# EAGLE design HiFi_Module_r1_3 (EAGLE 9.6.2)
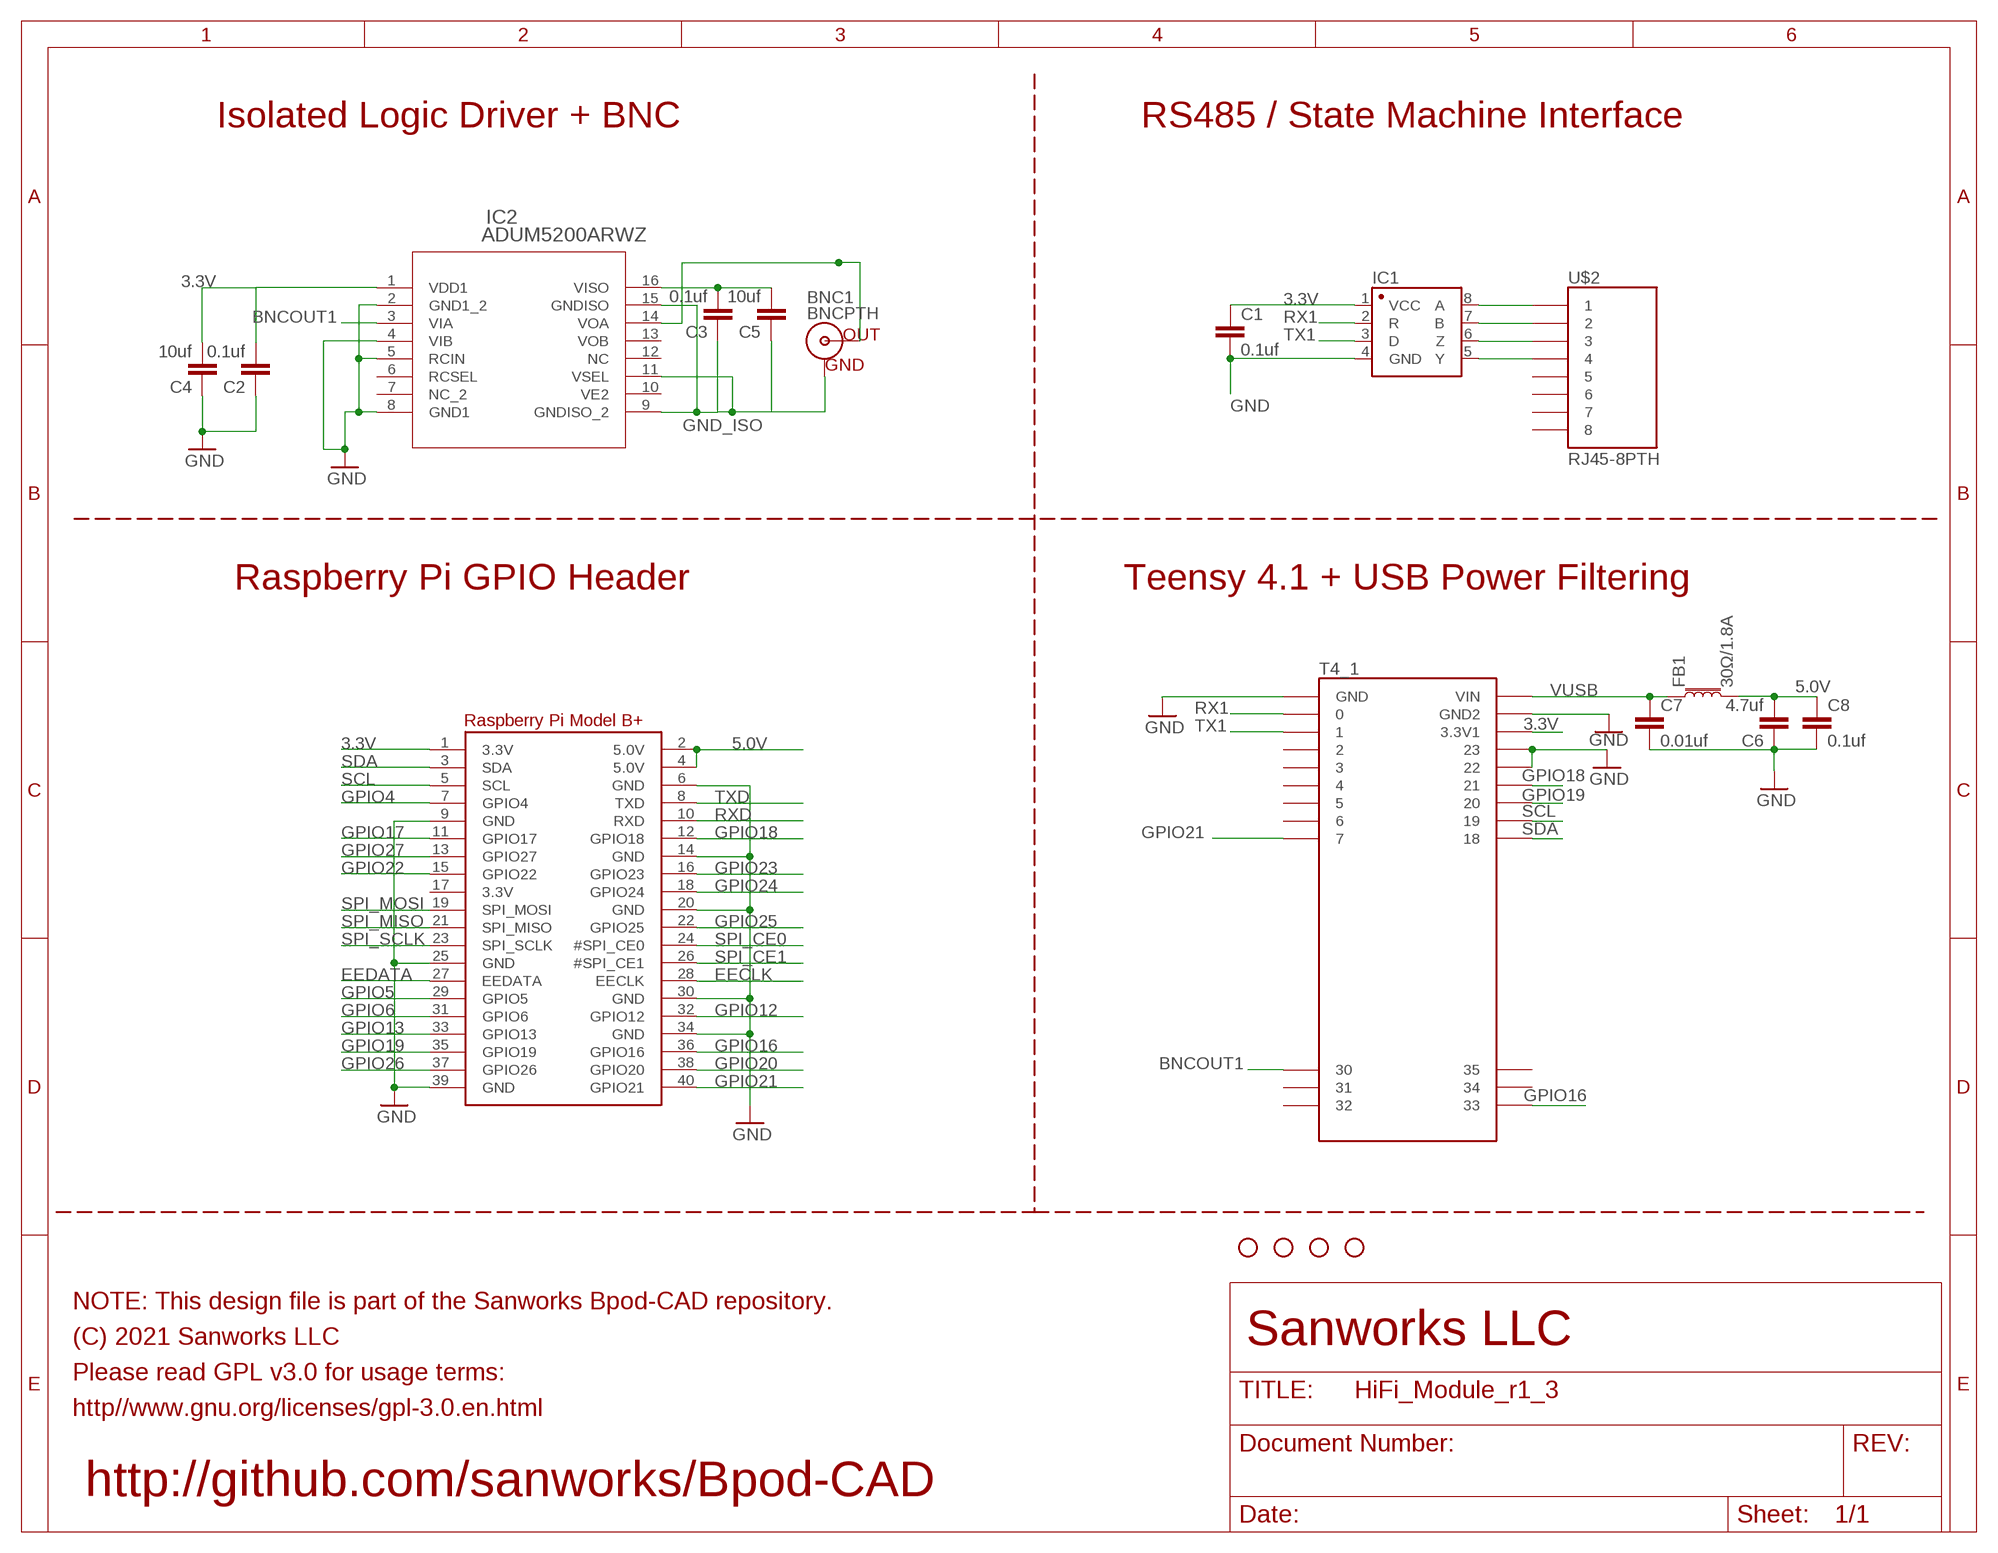
[diagram p0: schematic, sheet 1]

## Parts
BNC1  BNCPTH  [BNC]
C1  0.1uf  10UF-0805-10V-10%  [0805]
C2  0.1uf  10UF-0805-10V-10%  [0805]
C3  0.1uf  10UF-0805-10V-10%  [0805]
C4  10uf  CAP1206  [1206@2]
C5  10uf  CAP1206  [1206@2]
C6  4.7uf  CAP1206  [1206@2]
C7  0.01uf  10UF-0805-10V-10%  [0805]
C8  0.1uf  10UF-0805-10V-10%  [0805]
FB1  30Ω/1.8A  FERRITE_BEAD-0603  [0603]
H1  STAND-OFF  [STAND-OFF]
H2  STAND-OFF  [STAND-OFF]
H3  STAND-OFF  [STAND-OFF]
H4  STAND-OFF  [STAND-OFF]
IC1  SN65HVD31DR  [SO08]
IC2  ADUM5200ARWZ  [RW_16]
RPI1  RASPBERRYPI_BPLUS_IDC  [2X20]
T4_1  TEENSY4.1_FORAUDIO  [TEENSY4.1_FORAUDIO]
U$2  RJ45-8PTH  [RJ45-8]

## Nets
3.3V: C1.1 C2.2 C4.2 IC1.1(VCC) IC2.1(VDD1) RPI1.1(3.3V) T4_1.3V3_LO(3.3V1)
5.0V: C6.2 C8.1 FB1.2 RPI1.2(5.0V) RPI1.4(5.0V)
BNCOUT1: IC2.3(VIA) T4_1.30
EECLK: RPI1.28(EECLK)
EEDATA: RPI1.27(EEDATA)
GND: C1.2 C2.1 C4.1 C6.1 C7.2 C8.2 IC1.4(GND) IC2.2(GND1_2) IC2.4(VIB) IC2.5(RCIN) IC2.8(GND1) RPI1.6(GND) RPI1.9(GND) RPI1.14(GND) RPI1.20(GND) RPI1.25(GND) RPI1.30(GND) RPI1.34(GND) RPI1.39(GND) T4_1.22/A8 T4_1.23/A9 T4_1.AGND(GND) T4_1.GND(GND2)
GND_ISO: BNC1.GND C3.1 C5.1 IC2.9(GNDISO_2) IC2.11(VSEL) IC2.15(GNDISO)
GPIO4: RPI1.7(GPIO4)
GPIO5: RPI1.29(GPIO5)
GPIO6: RPI1.31(GPIO6)
GPIO12: RPI1.32(GPIO12)
GPIO13: RPI1.33(GPIO13)
GPIO16: RPI1.36(GPIO16) T4_1.33
GPIO17: RPI1.11(GPIO17)
GPIO18: RPI1.12(GPIO18) T4_1.21/A7
GPIO19: RPI1.35(GPIO19) T4_1.20/A6
GPIO20: RPI1.38(GPIO20)
GPIO21: RPI1.40(GPIO21) T4_1.7
GPIO22: RPI1.15(GPIO22)
GPIO23: RPI1.16(GPIO23)
GPIO24: RPI1.18(GPIO24)
GPIO25: RPI1.22(GPIO25)
GPIO26: RPI1.37(GPIO26)
GPIO27: RPI1.13(GPIO27)
N$1: IC1.6(Z) U$2.3
N$3: IC1.8(A) U$2.1
N$4: IC1.5(Y) U$2.4
N$5: IC1.7(B) U$2.2
N$27: C3.2 C5.2 IC2.16(VISO)
N$32: BNC1.S(OUT) IC2.14(VOA)
RX1: IC1.2(R) T4_1.0/RX
RXD: RPI1.10(RXD)
SCL: RPI1.5(SCL) T4_1.19/A5/SCL
SDA: RPI1.3(SDA) T4_1.18/A4/SDA
SPI_CE0: RPI1.24(#SPI_CE0)
SPI_CE1: RPI1.26(#SPI_CE1)
SPI_MISO: RPI1.21(SPI_MISO)
SPI_MOSI: RPI1.19(SPI_MOSI)
SPI_SCLK: RPI1.23(SPI_SCLK)
TX1: IC1.3(D) T4_1.1/TX
TXD: RPI1.8(TXD)
VUSB: C7.1 FB1.1 T4_1.VIN
Unconnected: IC2.6(RCSEL) IC2.7(NC_2) IC2.10(VE2) IC2.12(NC) IC2.13(VOB) RPI1.17(3.3V) T4_1.2 T4_1.3 T4_1.4 T4_1.5 T4_1.6 T4_1.31/A12 T4_1.32 T4_1.34 T4_1.35 U$2.5 U$2.6 U$2.7 U$2.8

## Notes on the sheet
- Isolated Logic Driver + BNC | RS485 / State Machine Interface
- Raspberry Pi GPIO Header | Teensy 4.1 + USB Power Filtering
- NOTE: This design file is part of the Sanworks Bpod-CAD repository.
- (C) 2021 Sanworks LLC | Sanworks LLC
- Please read GPL v3.0 for usage terms:
- http//www.gnu.org/licenses/gpl-3.0.en.html
- http://github.com/sanworks/Bpod-CAD

## Library data of the parts
BNC1 = SparkFun-Connectors:BNC: BNC Right Angle Connector Mouser Part# 5227161 SparkFun Products: BNC Connector - Right Angle <https://www.sparkfun.com/products/10550>; PROD_ID: LPA-12729; SF_ID: PRT-10550
C1-C3 C7 C8 = SparkFun-Capacitors:10UF: 10.0µF ceramic capacitors A capacitor is a passive two-terminal electrical component used to store electrical energy temporarily in an electric field.; PROD_ID: CAP-11330; VALUE: 10uF
C4-C6 = SparkFun-Capacitors:CAP: Capacitor Standard 0603 ceramic capacitor, and 0.1" leaded capacitor.
FB1 = SparkFun-Coils:FERRITE_BEAD: Ferrite Bead (blocks, cores, rings, chokes, etc.) Inductor with layers of ferrite used to suppress high frequencies. Often used to isolate high frequency noise. SparkFun Products: IOIO-OTG - V2.2 <https://www.sparkfun.com/products/13613> SparkFun SAMD21 Mini Breakout <https://www.sparkfun.com/products/13664> SparkFun 6 Degrees of Freedom Breakout - LSM6DS3 <https://www.sparkfun.com/products/13339> SparkFun SAMD21 Dev Breakout <https://www.sparkfun.com/products/13672>; PROD_ID: NDUC-13805
H1-H4 = SparkFun-Hardware:STAND-OFF: Stand Off Drill holes for mechanically mounting via screws, standoffs, etc. Note: Use the keepout ring to avoid running the screw head into surrounding components. Variant Overviews STAND-OFF - Mechanical footprint for a #4 phillips button head screw. STAND-OFF-TIGHT - Mechanical footprint for a #4 phillips button head screw, Example SparkFun Products Screw - Phillips Head (1/4", 4-40, 10 pack) <https://www.sparkfun.com/products/10453> (PRT-10453) Screw - Phillips Head (1/2", 4-40, 10 pack) <https://www.sparkfun.com/products/10452> (PRT-10452) Screw - Phillips Head (3/4", 4-40, 10 pack) <https://www.sparkfun.com/products/10451> (PRT-10451) Screw - Phillips Head (1", 4-40, 10 pack) <https://www.sparkfun.com/products/10450> (PRT-10450)
IC1 = Joshparts4:SN65HVD31DR: A placeholder for generic narrow & wide SOIC8 foorptints - used on the DIP adapter board.
IC2 = ADUM5200:ADUM5200ARWZ
RPI1 = microbuilder:RASPBERRYPI_BPLUS
T4_1 = teensy4.1.dist:TEENSY4.1_FORAUDIO
U$2 = SparkFun:RJ45-8: RJ45 Jack Simple RJ45, 8-pin connection - connector for common Cat5, Cat5e, and Cat6 Ethernet cables. Footprint not yet proven in production. Connector sku is PRT-00643; Breakout PCB sku is BOB-00716.

## Board
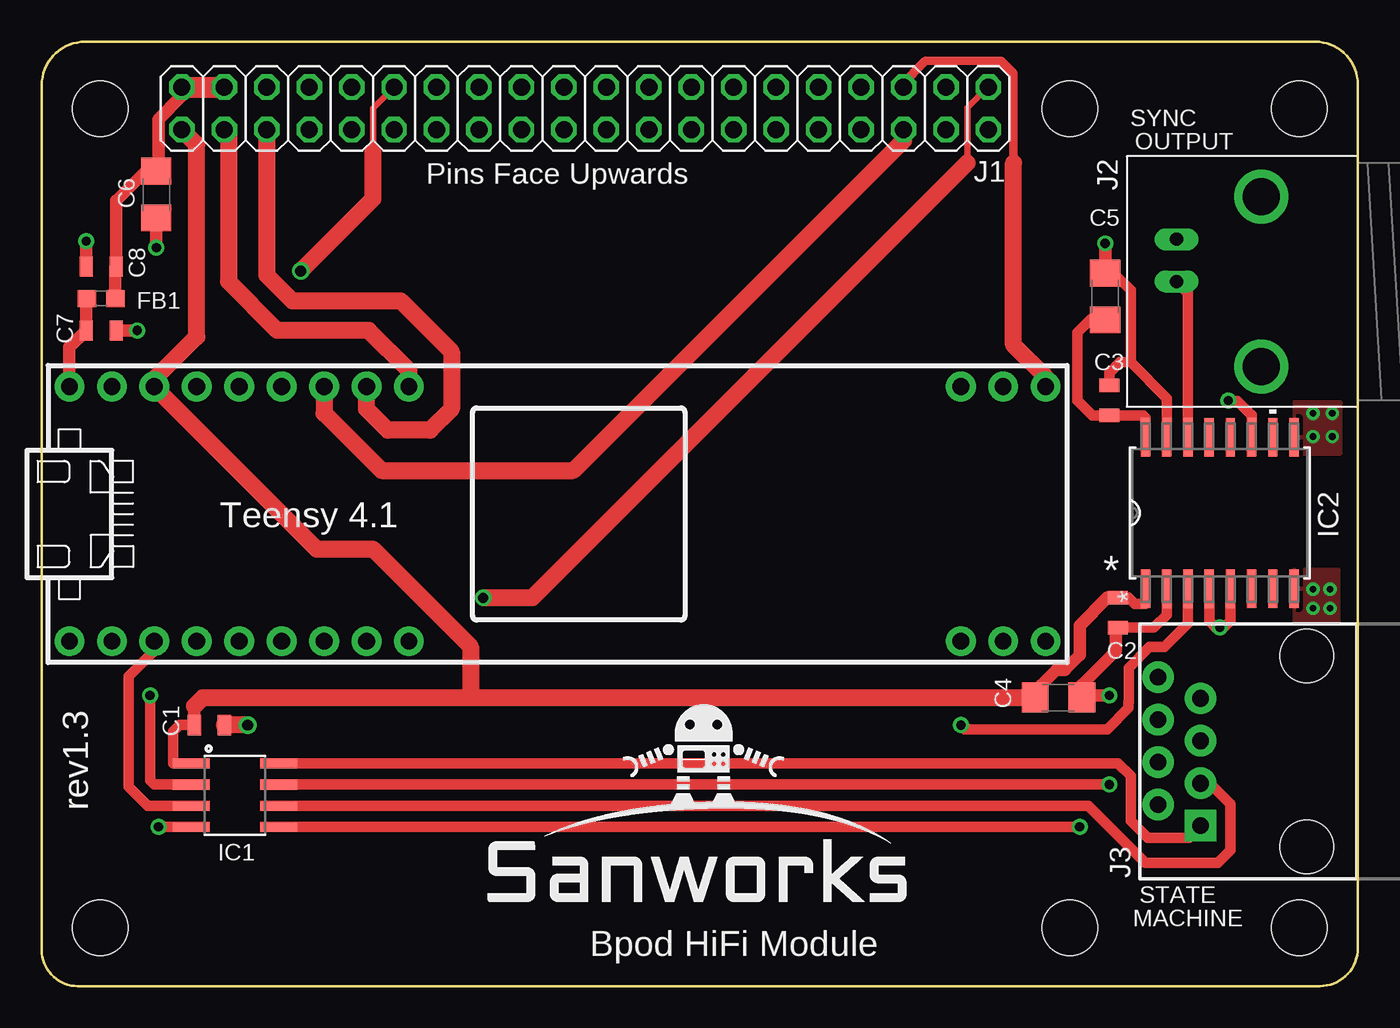
[diagram p1: board, top side]
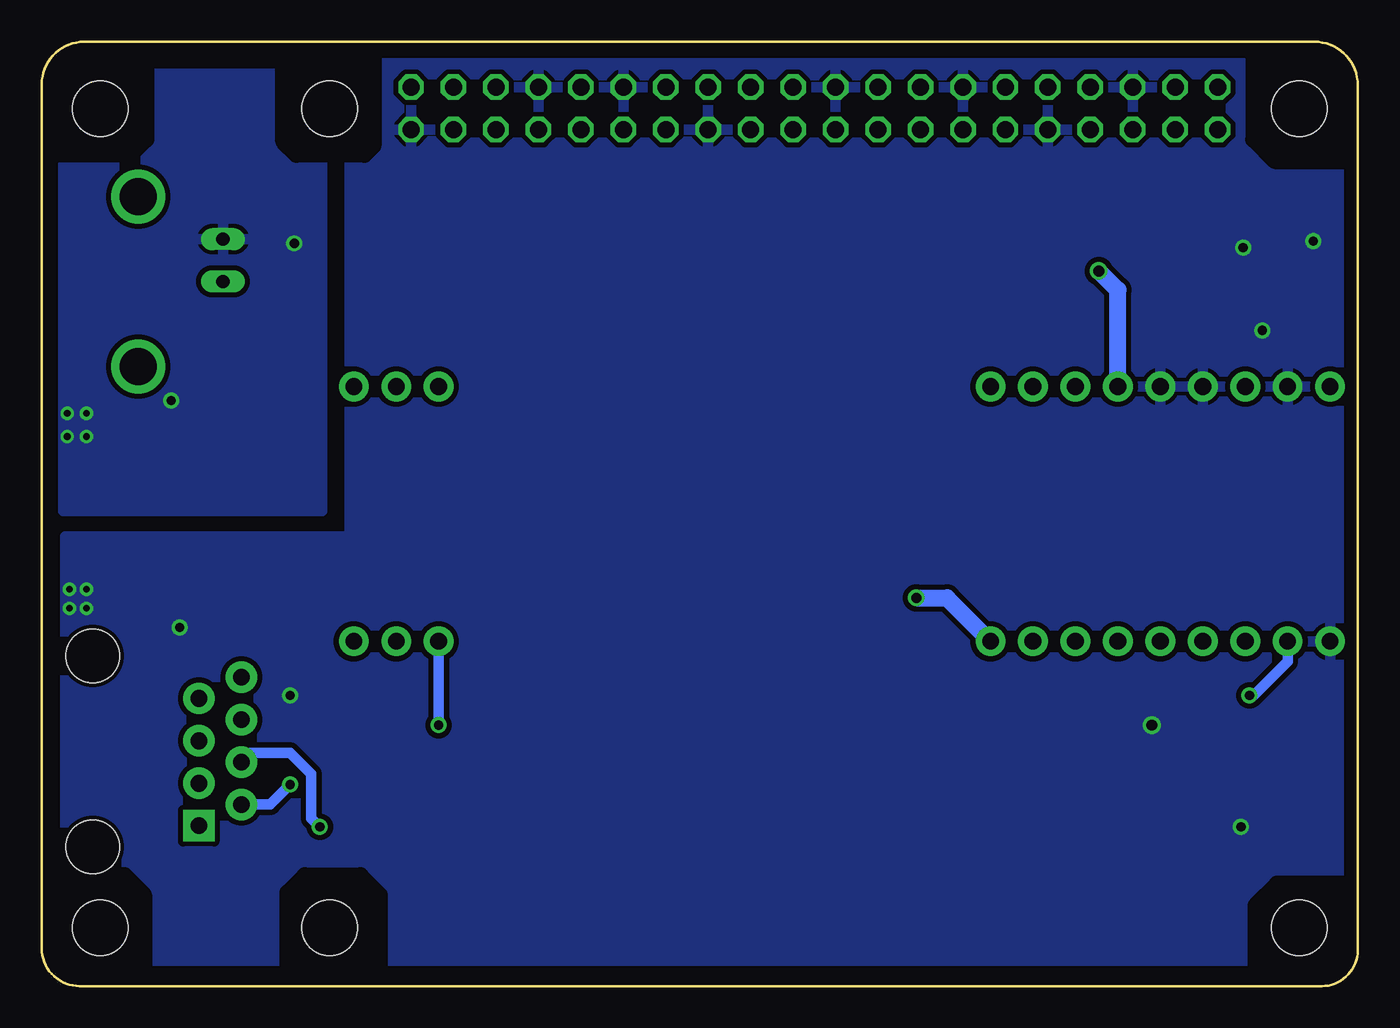
[diagram p2: board, bottom side, seen from below]

Size 78.74 x 56.52 mm. Coordinates in mm from the lower left corner, seen from the top.
Outline: 0,19.56 0,19.68
Outline: 0,53.93 0,2.15 arc90 2.15,0 76.46,0 arc90 78.74,2.28 78.74,53.98 arc90 76.2,56.52 2.59,56.52 arc90 0,53.93
Copper layers (1*16): Top 0.035mm / dielectric 1.5mm / Bottom 0.035mm
Design rules "adafruit *": minimum track width 8mil, minimum drill 15.5mil, track to track 12mil, track to pad 7mil, pad to pad 12mil, via to via 12mil, smd to smd 12mil, copper to edge 10mil, drill to drill 8mil, minimum pad ring 10mil, minimum via ring 8mil, stop-mask expansion 2mil, vias tented up to drill 20mil, thermal gap 10mil
bRestrict: area 0.9,49.4 to 6.2,55.6; area 58.9,49.8 to 64.3,55.6; area 58.5,0.6 to 64,6.6; area 0.4,0.6 to 6.1,6.1; area 72.6,0.5 to 78,6.6; area 72.5,49.8 to 77.9,55.5

### Footprints (pad centres in the part's own frame; a part is rotated, then mirrored left to right if it is on the bottom)
BNC = drill 2.2: 3 -5.08,5.08; 4 5.08,5.08 | drill 0.8 long: GND -2.54,0; S 0,0
0805 = smd 0.8 x 1.2: 1 -0.9,0; 2 0.9,0
1206@2 = smd 1.6 x 1.8: 1 -1.4,0; 2 1.4,0
0603 = smd 1.1 x 1: 1 -0.85,0; 2 0.85,0
STAND-OFF = hole 3.302: 0,0
SO08 = smd 0.61 x 2.21: 1 -1.905,-2.616; 2 -0.635,-2.616; 3 0.635,-2.616; 4 1.905,-2.616; 5 1.905,2.616; 6 0.635,2.616; 7 -0.635,2.616; 8 -1.905,2.616
RW_16 = smd 2.299 x 0.559: 1 -4.528,4.445; 2 -4.528,3.175; 3 -4.528,1.905; 4 -4.528,0.635; 5 -4.528,-0.635; 6 -4.528,-1.905; 7 -4.528,-3.175; 8 -4.528,-4.445; 9 4.528,-4.445; 10 4.528,-3.175; 11 4.528,-1.905; 12 4.528,-0.635; 13 4.528,0.635; 14 4.528,1.905; 15 4.528,3.175; 16 4.528,4.445
2X20 = drill 1.016 octagon: 1 -24.13,-1.27; 2 -24.13,1.27; 3 -21.59,-1.27; 4 -21.59,1.27; 5 -19.05,-1.27; 6 -19.05,1.27; 7 -16.51,-1.27; 8 -16.51,1.27; 9 -13.97,-1.27; 10 -13.97,1.27; 11 -11.43,-1.27; 12 -11.43,1.27; 13 -8.89,-1.27; 14 -8.89,1.27; 15 -6.35,-1.27; 16 -6.35,1.27; 17 -3.81,-1.27; 18 -3.81,1.27; 19 -1.27,-1.27; 20 -1.27,1.27; 21 1.27,-1.27; 22 1.27,1.27; 23 3.81,-1.27; 24 3.81,1.27; 25 6.35,-1.27; 26 6.35,1.27; 27 8.89,-1.27; 28 8.89,1.27; 29 11.43,-1.27; 30 11.43,1.27; 31 13.97,-1.27; 32 13.97,1.27; 33 16.51,-1.27; 34 16.51,1.27; 35 19.05,-1.27; 36 19.05,1.27; 37 21.59,-1.27; 38 21.59,1.27; 39 24.13,-1.27; 40 24.13,1.27
TEENSY4.1_FORAUDIO = drill 1 pad 1.778: 0/RX -26.67,-7.62; 1/TX -24.13,-7.62; 2 -21.59,-7.62; 3 -19.05,-7.62; 3V3_LO -24.13,7.62; 4 -16.51,-7.62; 5 -13.97,-7.62; 6 -11.43,-7.62; 7 -8.89,-7.62; 18/A4/SDA -8.89,7.62; 19/A5/SCL -11.43,7.62; 20/A6 -13.97,7.62; 21/A7 -16.51,7.62; 22/A8 -19.05,7.62; 23/A9 -21.59,7.62; 30 24.13,-7.62; 31/A12 26.67,-7.62; 32 29.21,-7.62; 33 29.21,7.62; 34 26.67,7.62; 35 24.13,7.62; AGND -26.67,7.62; GND -29.21,-7.62; VIN -29.21,7.62
RJ45-8 = drill 1 pad 1.88 square: 1 -4.445,6.35 | drill 1 pad 1.88: 2 -3.175,8.89; 3 -1.905,6.35; 4 -0.635,8.89; 5 0.635,6.35; 6 1.905,8.89; 7 3.175,6.35; 8 4.445,8.89 | hole 3.2: -5.715,0; 5.715,0

### Placement (x,y rotation side)
BNC1  67.89,42.16 270 top
C1  10.03,15.62 0 top
C2  64.39,22.35 90 top
C3  63.88,35.05 270 top
C4  60.83,17.27 180 top
C5  63.63,41.27 270 top
C6  6.86,47.37 90 top
C7  3.56,39.24 0 top
C8  3.56,43.05 180 top
FB1  3.56,41.15 0 top
H1  61.51,3.5 0 top
H2  3.51,3.5 0 top
H3  61.51,52.5 0 top
H4  3.51,52.5 0 top
H5  STAND-OFF  [STAND-OFF]  75.23,52.5 0 top
H6  STAND-OFF  [STAND-OFF]  75.23,3.5 0 top
IC1  11.56,11.43 270 top
IC2  70.48,28.32 90 top
RPI1  32.51,52.53 0 top
T4_1  30.86,28.26 0 top
U$1  [SANWORKS_LOGO]  26.42,4.83 0 top
U$2  75.69,14.05 90 top

### Tracks (layer width: path | path; a pad name or v marks a point on that pad's centre or on a via)
3.3V
  Top 0.635: IC1.1 7.87,13.34 7.87,15.24 8.26,15.62 C1.1 | IC2.1 66.04,22.86 65.41,22.86 65.01,23.25 C2.2 | 59.56,17.27 C4.2
  Top 0.762: C1.1 9.13,16.75 | C2.2 63.77,23.25 62.1,21.59 62.1,19.81 61.21,18.92 60.71,18.92 59.82,18.03 59.82,17.66 C4.2
  Top 1.016: RPI1.1 9.27,50.37 9.27,38.86 6.73,36.32 T4_1.3V3_LO 16.45,26.16 19.81,26.16 25.65,20.32 25.65,17.27 | 25.65,17.27 C4.2 | 9.13,16.75 9.65,17.27 25.65,17.27
5.0V
  Top 0.762: RPI1.2 8.38,53.29 6.99,51.89 6.99,48.9 C6.2 6.73,48.9 6.35,48.9 4.46,47 C8.1 4.41,43 FB1.2
  Top 1.27: RPI1.2 RPI1.4
BNCOUT1  (via drill 0.55)
  Top 0.635: IC2.3 68.58,21.72 67.17,20.31 66.28,20.31 65.03,19.06 65.03,16.98 65.02,16.97 65.02,16.64 63.75,15.37 55.24,15.37 v54.99,15.62
  Bottom 0.635: T4_1.30 v54.99,15.62
GND  (via drill 0.39, 0.55, 0.65)
  Top 0.635: IC1.4 v6.99,9.53 | IC2.5 71.12,21.84 70.74,21.46 v70.48,21.46 70.23,21.46 69.85,21.84 IC2.4 | IC2.2 67.31,22.23 66.55,21.46 C2.1
  Top 0.762: v63.88,17.4 62.36,17.4 C4.1 62.23,18.04 64.26,20.07 64.26,21.32 C2.1 | C8.2 2.66,44.57 v2.67,44.58 | C7.2 v5.71,39.24 | C6.1 v6.86,44.2
  Top 1.016: v12.32,15.62 C1.2
  other vias: 76.07,23.75 76.07,22.61 77.09,22.61 77.09,23.75
  pour Bottom: 1.14,55.24 1.14,1.52 77.34,1.52 77.34,26.92 60.33,26.92 60.33,55.24
  pour Top: 74.93,24.89 74.93,21.84 77.6,21.84 77.6,24.89
GND_ISO  (via drill 0.39, 0.55)
  Top 0.635: IC2.15 67.31,35.18 65.15,37.34 | 65.15,37.34 65.15,41.66 64.13,42.67 C5.1 | 65.15,37.34 64.52,37.34 63.88,36.7 C3.1 | IC2.11 72.39,34.16 72.37,34.16 71.53,35 71.04,35 v70.99,35.05
  Top 0.762: v63.63,44.45 C5.1
  other vias: 76.07,34.29 76.07,32.89 77.22,34.29 77.22,32.89
  pour Bottom: 77.47,28.45 61.98,28.45 61.98,54.61 77.47,54.61
  pour Top: 74.93,31.88 77.72,31.88 77.72,34.92 74.93,34.92
GPIO16
  Top 0.508: 58.15,49.28 58.15,54.63 57.4,55.37 52.88,55.37 51.44,53.92 RPI1.36
  Top 1.016: T4_1.33 60.07,36.45 58.15,38.37 58.15,49.28
GPIO18  (via drill 0.65)
  Top 0.381: 19.81,49.91 19.81,52.53 RPI1.12
  Top 1.016: v15.49,42.8 19.81,47.12 19.81,49.91
  Bottom 1.016: T4_1.21/A7 14.35,41.66 v15.49,42.8
GPIO19
  Top 1.016: T4_1.20/A6 16.89,34.29 20.32,30.86 31.82,30.86 51.56,50.61 RPI1.35
GPIO21  (via drill 0.6)
  Top 0.381: 55.37,49.28 55.37,52.58 56.59,53.8 RPI1.40
  Top 1.016: v26.42,23.24 29.34,23.24 55.37,49.28
  Bottom 1.016: v26.42,23.24 24.57,23.24 T4_1.7
N$1
  Top 0.635: U$2.3 69.9,12.14 71.12,10.92 71.12,8.13 70.36,7.37 66.04,7.37 62.61,10.79 IC1.6
N$3
  Top 0.635: IC1.8 64.39,13.34 65.15,12.57 65.15,9.91 66.17,8.89 68.63,8.89 U$2.1
N$4  (via drill 0.55)
  Top 0.635: IC1.5 v62.1,9.53
  Bottom 0.635: v62.1,9.53 62.61,10.03 62.61,12.7 63.88,13.97 66.24,13.97 U$2.4
N$5  (via drill 0.55)
  Top 0.635: IC1.7 v63.88,12.06
  Bottom 0.635: U$2.2 65.08,10.87 v63.88,12.06
N$27
  Top 0.635: IC2.16 66.04,34.04 65.92,34.16 C3.2 62.88,34.15 61.98,35.05 61.98,39.12 62.73,39.88 C5.2
N$32
  Top 0.635: IC2.14 68.58,41.48 BNC1.S
RX1  (via drill 0.55)
  Top 0.635: IC1.2 6.73,12.06 6.48,12.32 v6.48,17.4
  Bottom 0.635: v6.48,17.4 6.22,17.4 4.19,19.43 T4_1.0/RX
SCL
  Top 1.016: T4_1.19/A5/SCL 19.43,34.54 20.7,33.27 23.24,33.27 24.51,34.54 24.51,37.97 21.46,41.02 14.99,41.02 13.46,42.55 RPI1.5
SDA
  Top 1.016: T4_1.18/A4/SDA 21.97,36.83 19.56,39.24 14.1,39.24 11.18,42.16 11.18,51 RPI1.3
TX1
  Top 0.635: IC1.3 6.35,10.79 5.21,11.94 5.21,18.54 6.73,20.07 T4_1.1/TX
VUSB
  Top 0.762: T4_1.VIN 1.65,38.24 C7.1 2.66,41.1 FB1.1

### Text on the board
tPlace: SYNC | OUTPUT | Pins Face Upwards | J1 | J2 | Teensy 4.1 | * | rev1.3 | J3 | STATE | MACHINE | Bpod HiFi Module
tSilk: + | + | + | +